# EAGLE design Breakout (EAGLE 5.11)
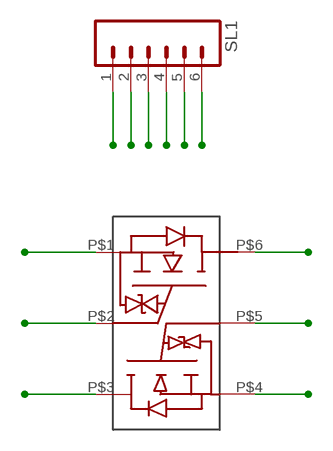
[diagram p0: schematic, sheet 1]

## Parts
SL1  M06  [06P]
U$1  US6K1TR  [TUMT6]

## Nets
1: SL1.1 U$1.P$1
2: SL1.2 U$1.P$2
3: SL1.3 U$1.P$3
4: SL1.4 U$1.P$4
5: SL1.5 U$1.P$5
6: SL1.6 U$1.P$6

## Library data of the parts
SL1 = con-amp-quick:M06: AMP QUICK CONNECTOR; OC_FARNELL: unknown; OC_NEWARK: unknown
U$1 = Nullspace:US6K1TR: US6K1TR MOSFET

## Board
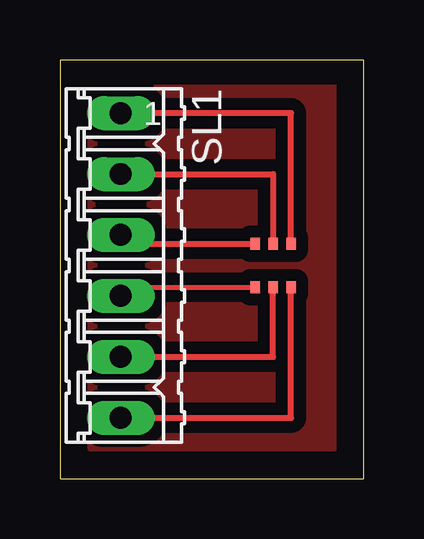
[diagram p1: board, top side]

Size 12.68 x 17.45 mm. Coordinates in mm from the lower left corner, seen from the top.
Outline: 0,0 12.68,0 12.68,17.45 0,17.45 0,0
Copper layers (1*16): Top 0.035mm / dielectric 1.5mm / Bottom 0.035mm
Design rules "default": minimum track width 10mil, minimum drill 24mil, track to track 8mil, track to pad 8mil, pad to pad 8mil, via to via 8mil, smd to smd 8mil, copper to edge 40mil, drill to drill 8mil, minimum pad ring 10mil, minimum via ring 8mil, stop-mask expansion 4mil, vias tented up to drill 0mil, thermal gap 10mil
Milling: 4 lines

### Footprints (pad centres in the part's own frame; a part is rotated, then mirrored left to right if it is on the bottom)
06P = drill 0.914 long: 1 -6.35,0; 2 -3.81,0; 3 -1.27,0; 4 1.27,0; 5 3.81,0; 6 6.35,0
TUMT6 = smd 0.4 x 0.5: P$1 -0.75,-0.9; P$2 0,-0.9; P$3 0.75,-0.9; P$4 0.75,0.9; P$5 0,0.9; P$6 -0.75,0.9

### Placement (x,y rotation side)
SL1  2.54,8.89 270 top
U$1  8.89,8.89 180 top

### Tracks (layer width: path | path; a pad name or v marks a point on that pad's centre or on a via)
1
  Top 0.254: SL1.1 9.64,15.24 U$1.P$1
2
  Top 0.254: U$1.P$2 8.89,12.7 SL1.2
3
  Top 0.254: U$1.P$3 2.91,9.79 SL1.3
4
  Top 0.203: 2.91,7.99 U$1.P$4
  Top 0.254: SL1.4 2.91,7.99
5
  Top 0.254: U$1.P$5 8.89,5.08 SL1.5
6
  Top 0.254: U$1.P$6 9.64,2.54 SL1.6
GND
  pour Top (isolate 0.508): 11.43,16.51 1.27,16.51 1.27,1.27 11.43,1.27